# EAGLE design Shield r0 (EAGLE 6.5.0)
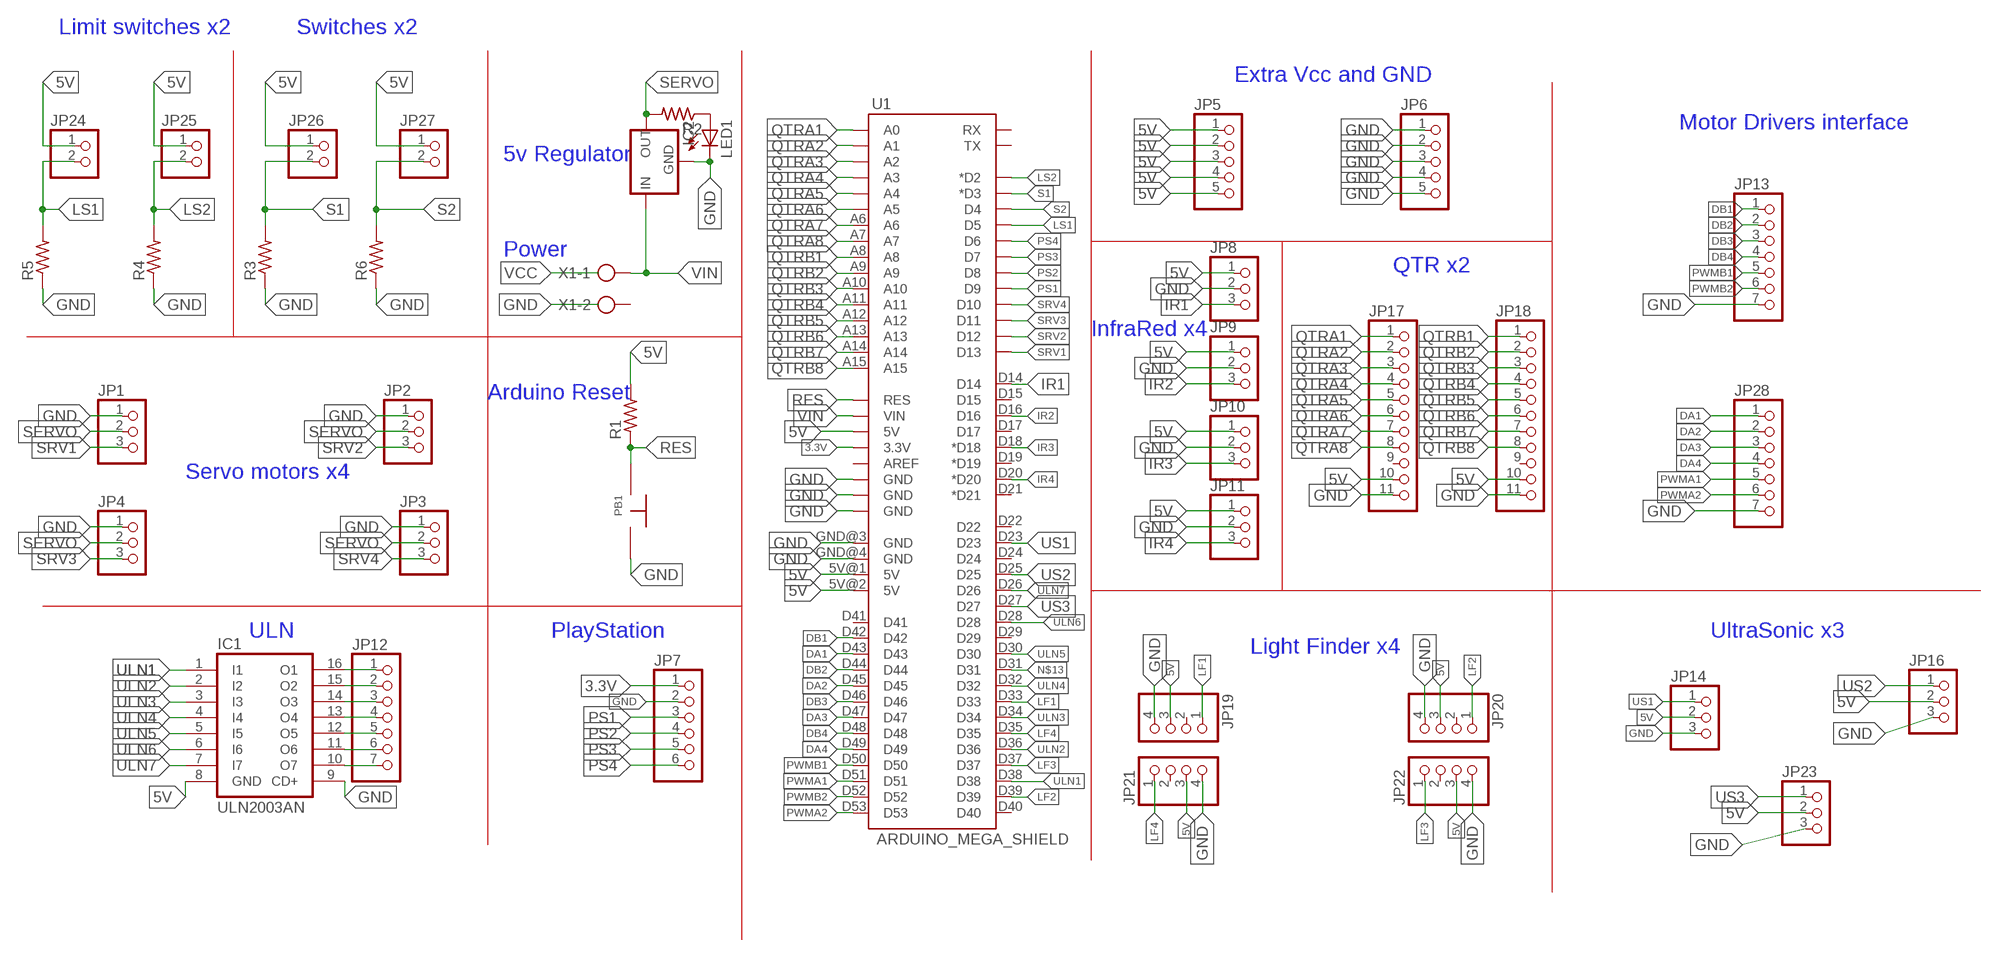
[diagram p0: schematic, sheet 1]

## Parts
IC1  ULN2003AN  [DIL16]
IC2  78XXS  [78XXS]
JP1  PINHD-1X3  [1X03]
JP2  PINHD-1X3  [1X03]
JP3  PINHD-1X3  [1X03]
JP4  PINHD-1X3  [1X03]
JP5  PINHD-1X5  [1X05]
JP6  PINHD-1X5  [1X05]
JP7  PINHD-1X6  [1X06]
JP8  PINHD-1X3  [1X03]
JP9  PINHD-1X3  [1X03]
JP10  PINHD-1X3  [1X03]
JP11  PINHD-1X3  [1X03]
JP12  PINHD-1X7  [1X07]
JP13  PINHD-1X7  [1X07]
JP14  PINHD-1X3  [1X03]
JP16  PINHD-1X3  [1X03]
JP17  PINHD-1X11  [1X11]
JP18  PINHD-1X11  [1X11]
JP19  PINHD-1X4  [1X04]
JP20  PINHD-1X4  [1X04]
JP21  PINHD-1X4  [1X04]
JP22  PINHD-1X4  [1X04]
JP23  PINHD-1X3  [1X03]
JP24  PINHD-1X2  [1X02]
JP25  PINHD-1X2  [1X02]
JP26  PINHD-1X2  [1X02]
JP27  PINHD-1X2  [1X02]
JP28  PINHD-1X7  [1X07]
LED1  LED5MM  [LED5MM]
PB1  PUSH  [PUSHBUTTON]
R1  R-US_0207/10  [0207/10]
R2  R-US_0207/10  [0207/10]
R3  R-US_0207/10  [0207/10]
R4  R-US_0207/10  [0207/10]
R5  R-US_0207/10  [0207/10]
R6  R-US_0207/10  [0207/10]
U1  ARDUINO_MEGA_SHIELD  [ARDUINO_MEGA_SHIELD]
X1  AK500/2-H  [AK500/2-H]

## Nets
3.3V: JP7.1 U1.3.3V
5V: IC1.8(GND) JP5.1 JP5.2 JP5.3 JP5.4 JP5.5 JP8.1 JP9.1 JP10.1 JP11.1 JP14.2 JP16.2 JP17.10 JP18.10 JP19.3 JP20.3 JP21.3 JP22.3 JP23.2 JP24.1 JP25.1 JP26.1 JP27.1 R1.2 U1.5V@0(5V) U1.5V@1(5V) U1.5V@2(5V)
DA1: JP28.1 U1.D43
DA2: JP28.2 U1.D45
DA3: JP28.3 U1.D47
DA4: JP28.4 U1.D49
DB1: JP13.1 U1.D42
DB2: JP13.2 U1.D44
DB3: JP13.3 U1.D46
DB4: JP13.4 U1.D48
GND: IC1.9(CD+) IC2.GND JP1.1 JP2.1 JP3.1 JP4.1 JP6.1 JP6.2 JP6.3 JP6.4 JP6.5 JP7.2 JP8.2 JP9.2 JP10.2 JP11.2 JP13.7 JP14.3 JP16.3 JP17.11 JP18.11 JP19.4 JP20.4 JP21.4 JP22.4 JP23.3 JP28.7 LED1.K(C) PB1.P$2 R3.1 R4.1 R5.1 R6.1 U1.GND@0(GND) U1.GND@1(GND) U1.GND@2(GND) U1.GND@3(GND) U1.GND@4(GND)
IR1: JP8.3 U1.D14
IR2: JP9.3 U1.D16
IR3: JP10.3 U1.D18(*D18)
IR4: JP11.3 U1.D20(*D20)
LF1: JP19.1 U1.D33
LF2: JP20.1 U1.D39
LF3: JP22.1 U1.D37
LF4: JP21.1 U1.D35
LS1: JP24.2 R5.2 U1.D5
LS2: JP25.2 R4.2 U1.D2(*D2)
N$1: LED1.A R2.1
N$2: IC1.16(O1) JP12.1
N$3: IC1.15(O2) JP12.2
N$4: IC1.14(O3) JP12.3
N$5: IC1.13(O4) JP12.4
N$6: IC1.12(O5) JP12.5
N$7: IC1.11(O6) JP12.6
N$8: IC1.10(O7) JP12.7
N$13: U1.D31
PS1: JP7.3 U1.D9
PS2: JP7.4 U1.D8
PS3: JP7.5 U1.D7
PS4: JP7.6 U1.D6
PWMA1: JP28.5 U1.D51
PWMA2: JP28.6 U1.D53
PWMB1: JP13.5 U1.D50
PWMB2: JP13.6 U1.D52
QTRA1: JP17.1 U1.A0
QTRA2: JP17.2 U1.A1
QTRA3: JP17.3 U1.A2
QTRA4: JP17.4 U1.A3
QTRA5: JP17.5 U1.A4
QTRA6: JP17.6 U1.A5
QTRA7: JP17.7 U1.A6
QTRA8: JP17.8 U1.A7
QTRB1: JP18.1 U1.A8
QTRB2: JP18.2 U1.A9
QTRB3: JP18.3 U1.A10
QTRB4: JP18.4 U1.A11
QTRB5: JP18.5 U1.A12
QTRB6: JP18.6 U1.A13
QTRB7: JP18.7 U1.A14
QTRB8: JP18.8 U1.A15
RES: PB1.P$1 R1.1 U1.RES
S1: JP26.2 R3.2 U1.D3(*D3)
S2: JP27.2 R6.2 U1.D4
SERVO: IC2.OUT JP1.2 JP2.2 JP3.2 JP4.2 R2.2
SRV1: JP1.3 U1.D13
SRV2: JP2.3 U1.D12
SRV3: JP4.3 U1.D11
SRV4: JP3.3 U1.D10
ULN1: IC1.1(I1) U1.D38
ULN2: IC1.2(I2) U1.D36
ULN3: IC1.3(I3) U1.D34
ULN4: IC1.4(I4) U1.D32
ULN5: IC1.5(I5) U1.D30
ULN6: IC1.6(I6) U1.D28
ULN7: IC1.7(I7) U1.D26
US1: JP14.1 U1.D23
US2: JP16.1 U1.D25
US3: JP23.1 U1.D27
VIN: IC2.IN U1.VIN X1.1
Unconnected: JP17.9 JP18.9 JP19.2 JP20.2 JP21.2 JP22.2 U1.AREF U1.D15 U1.D17 U1.D19(*D19) U1.D21(*D21) U1.D22 U1.D24 U1.D29 U1.D40 U1.D41 U1.RX U1.TX X1.2

## Notes on the sheet
- Limit switches x2 | Switches x2
- Extra Vcc and GND
- Motor Drivers interface
- 5v Regulator
- Power
- QTR x2
- InfraRed x4
- Arduino Reset
- Servo motors x4
- ULN | PlayStation | UltraSonic x3
- Light Finder x4

## Library data of the parts
IC1 = uln-udn:ULN2003A: DRIVER ARRAY
IC2 = v-reg:78XXS: VOLTAGE REGULATOR
JP1-JP4 JP8-JP11 JP14 JP16 JP23 = pinhead:PINHD-1X3: PIN HEADER
JP5 JP6 = pinhead:PINHD-1X5: PIN HEADER
JP7 = pinhead:PINHD-1X6: PIN HEADER
JP12 JP13 JP28 = pinhead:PINHD-1X7: PIN HEADER
JP17 JP18 = pinhead:PINHD-1X11: PIN HEADER
JP19-JP22 = pinhead:PINHD-1X4: PIN HEADER
JP24-JP27 = pinhead:PINHD-1X2: PIN HEADER
LED1 = led:LED: LED OSRAM: - CHIPLED LG R971, LG N971, LY N971, LG Q971, LY Q971, LO R971, LY R971 LH N974, LH R974 LS Q976, LO Q976, LY Q976 LO Q996 - Hyper CHIPLED LW Q18S LB Q993, LB Q99A, LB R99A - SideLED LS A670, LO A670, LY A670, LG A670, LP A670 LB A673, LV A673, LT A673, LW A673 LH A674 LY A675 LS A676, LA A676, LO A676, LY A676, LW A676 LS A679, LY A679, LG A679 - Hyper Micro SIDELED® LS Y876, LA Y876, LO Y876, LY Y876 LT Y87S - SmartLED LW L88C, LW L88S LB L89C, LB L89S, LG L890 LS L89K, LO L89K, LY L89K LS L896, LA L896, LO L896, LY L896 - TOPLED LS T670, LO T670, LY T670, LG T670, LP T670 LSG T670, LSP T670, LSY T670, LOP T670, LYG T670 LG T671, LOG T671, LSG T671 LB T673, LV T673, LT T673, LW T673 LH T674 LS T676, LA T676, LO T676, LY T676, LB T676, LH T676, LSB T676, LW T676 LB T67C, LV T67C, LT T67C, LS T67K, LO T67K, LY T67K, LW E67C LS E67B, LA E67B, LO E67B, LY E67B, LB E67C, LV E67C, LT E67C LW T67C LS T679, LY T679, LG T679 LS T770, LO T770, LY T770, LG T770, LP T770 LB T773, LV T773, LT T773, LW T773 LH T774 LS E675, LA E675, LY E675, LS T675 LS T776, LA T776, LO T776, LY T776, LB T776 LHGB T686 LT T68C, LB T68C - Hyper Mini TOPLED® LB M676 - Mini TOPLED Santana® LG M470 LS M47K, LO M47K, LY M47K Source: http://www.osram.convergy.de LUXEON: - LUMILED® LXK2-PW12-R00, LXK2-PW12-S00, LXK2-PW14-U00, LXK2-PW14-V00 LXK2-PM12-R00, LXK2-PM12-S00, LXK2-PM14-U00 LXK2-PE12-Q00, LXK2-PE12-R00, LXK2-PE12-S00, LXK2-PE14-T00, LXK2-PE14-U00 LXK2-PB12-K00, LXK2-PB12-L00, LXK2-PB12-M00, LXK2-PB14-N00, LXK2-PB14-P00, LXK2-PB14-Q00 LXK2-PR12-L00, LXK2-PR12-M00, LXK2-PR14-Q00, LXK2-PR14-R00 LXK2-PD12-Q00, LXK2-PD12-R00, LXK2-PD12-S00 LXK2-PH12-R00, LXK2-PH12-S00 LXK2-PL12-P00, LXK2-PL12-Q00, LXK2-PL12-R00 Source: www.luxeon.com KINGBRIGHT: KA-3528ASYC Source: www.kingbright.com
PB1 = pushbutton:PUSH
R1-R6 = rcl:R-US_: RESISTOR, American symbol
U1 = RepRapjr:ARDUINO_MEGA_SHIELD
X1 = con-ptr500:AK500/2-H: CONNECTOR Aug. 2004 / PTR Meßtechnik: Die Bezeichnung der Serie AK505 wurde geändert. Es handelt sich hierbei um AK500 in horizontaler Ausführung.; OC_FARNELL: unknown; OC_NEWARK: unknown

## Board
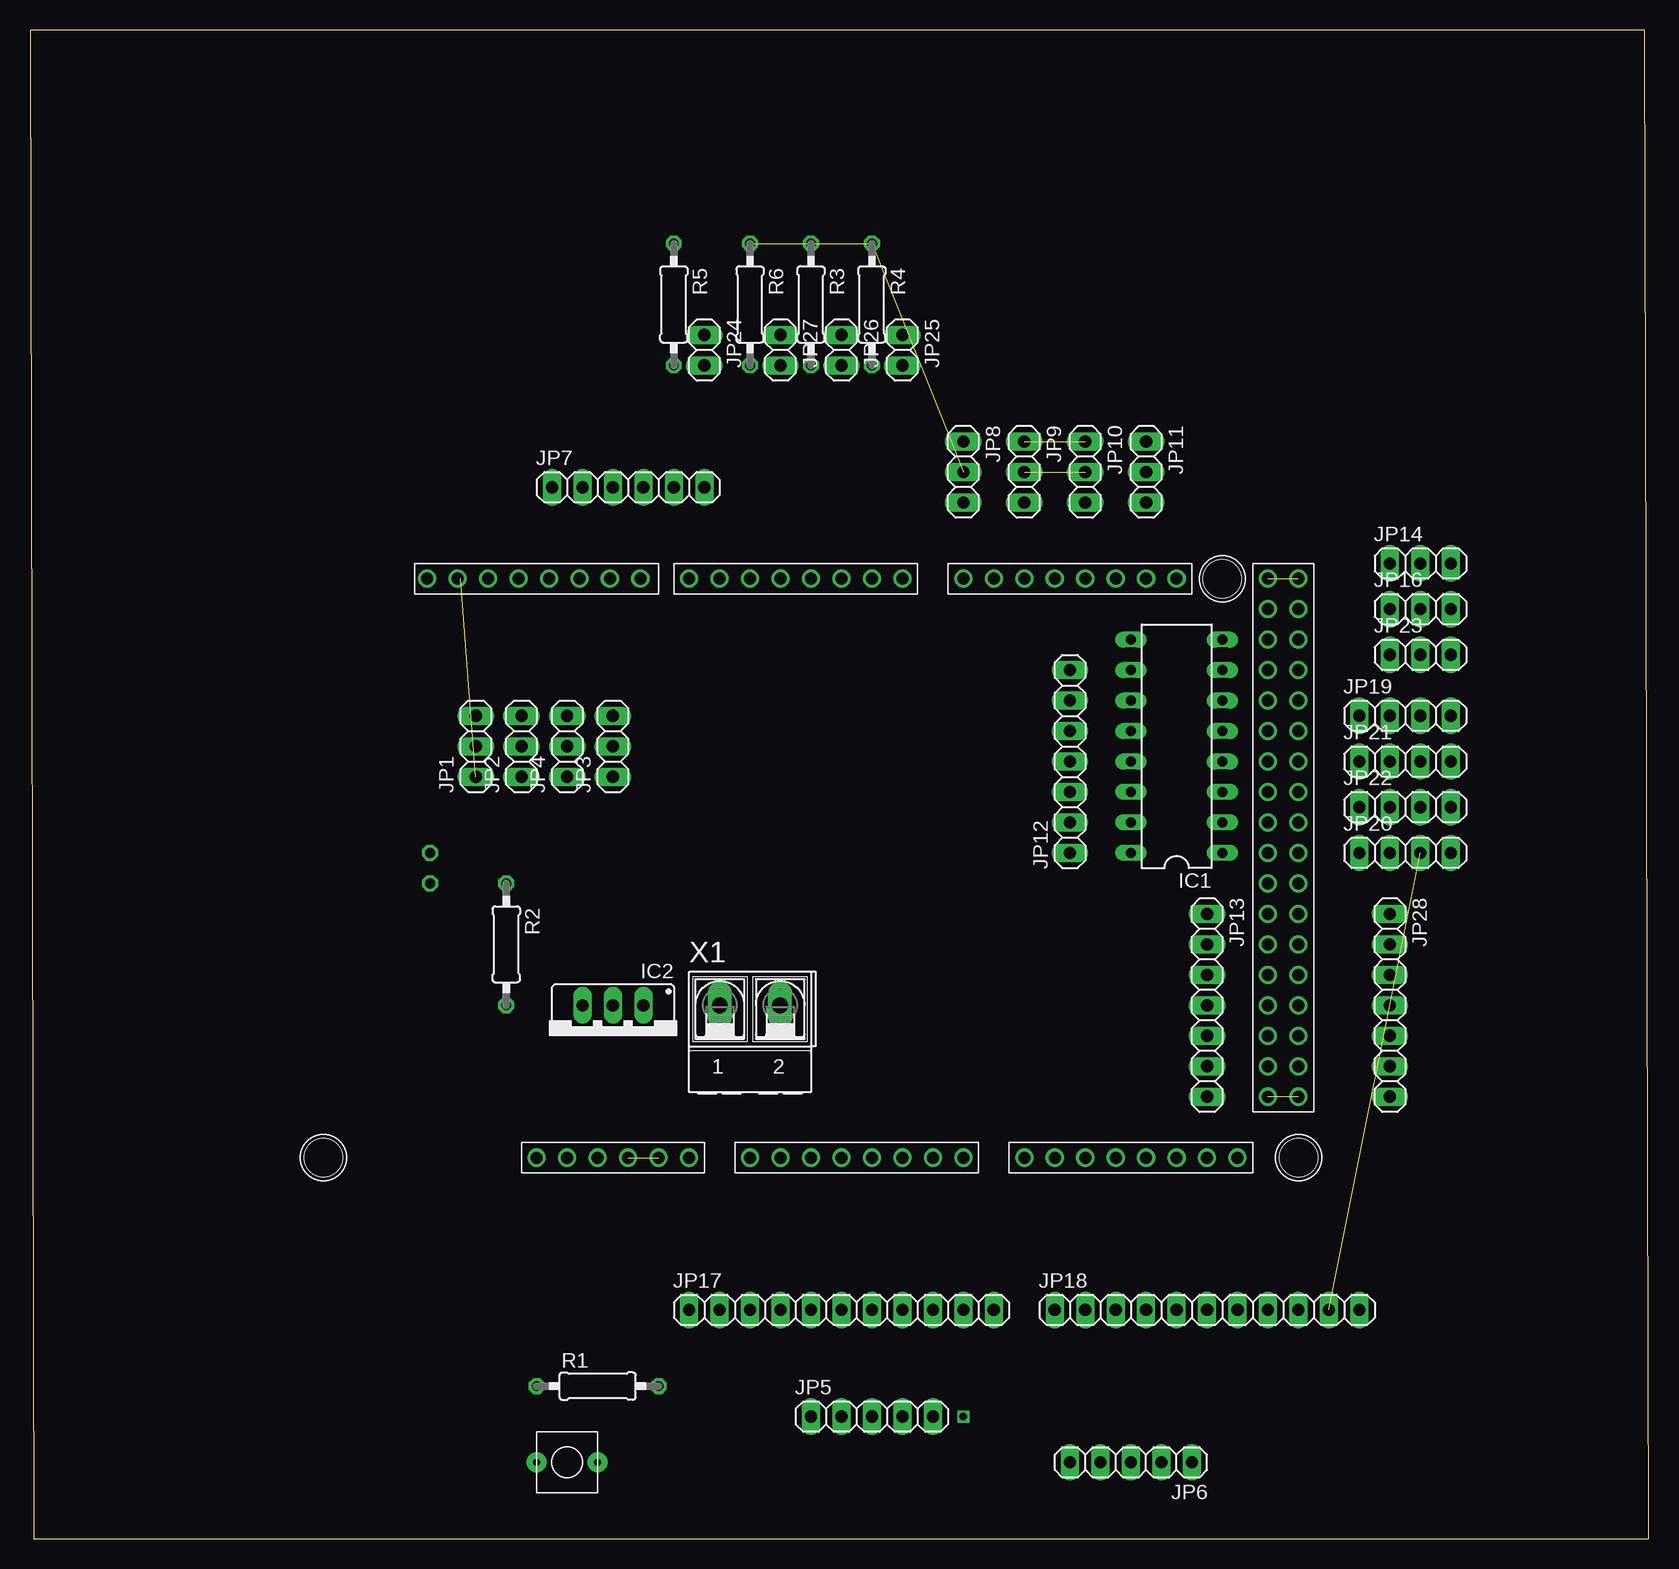
[diagram p1: board, top side]
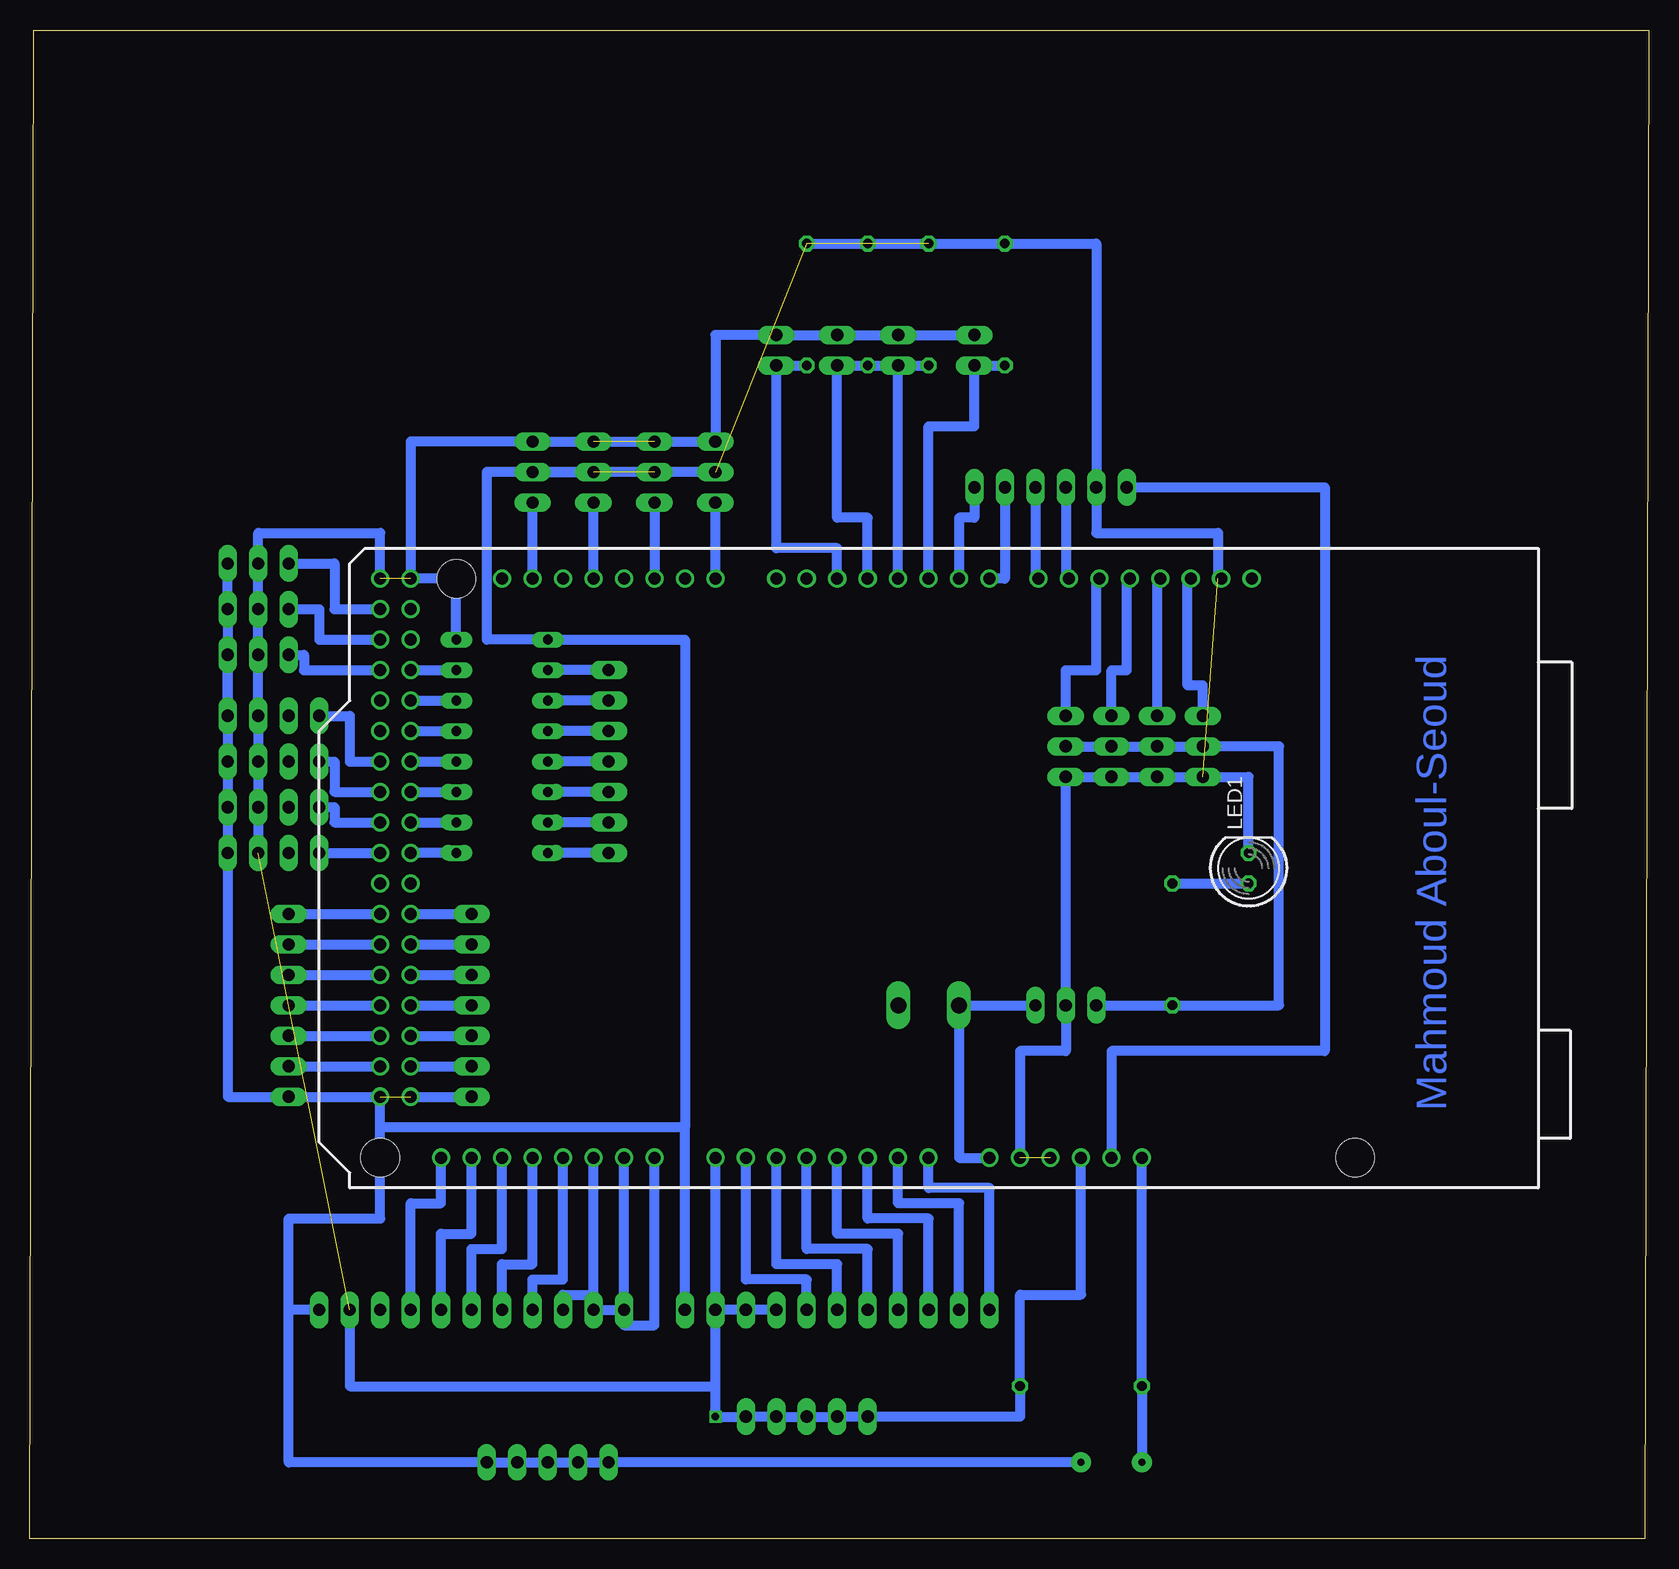
[diagram p2: board, bottom side, seen from below]

Size 134.93 x 125.75 mm. Coordinates in mm from the lower left corner, seen from the top.
Outline: 0.33,0 134.93,0 134.62,125.75 0,125.73 0.33,0
Copper layers (1*16): Top 0.035mm / dielectric 1.5mm / Bottom 0.035mm
Design rules "default": minimum track width 10mil, minimum drill 24mil, track to track 8mil, track to pad 8mil, pad to pad 8mil, via to via 8mil, smd to smd 8mil, copper to edge 40mil, drill to drill 8mil, minimum pad ring 10mil, minimum via ring 8mil, stop-mask expansion 4mil, vias tented up to drill 0mil, thermal gap 10mil

### Footprints (pad centres in the part's own frame; a part is rotated, then mirrored left to right if it is on the bottom)
DIL16 = drill 0.813 long: 1 -8.89,-3.81; 2 -6.35,-3.81; 3 -3.81,-3.81; 4 -1.27,-3.81; 5 1.27,-3.81; 6 3.81,-3.81; 7 6.35,-3.81; 8 8.89,-3.81; 9 8.89,3.81; 10 6.35,3.81; 11 3.81,3.81; 12 1.27,3.81; 13 -1.27,3.81; 14 -3.81,3.81; 15 -6.35,3.81; 16 -8.89,3.81
78XXS = drill 1.016 long: GND 0,-2.54; IN -2.54,-2.54; OUT 2.54,-2.54
1X03 = drill 1.016 long: 1 -2.54,0; 2 0,0; 3 2.54,0
1X05 = drill 1.016 long: 1 -5.08,0; 2 -2.54,0; 3 0,0; 4 2.54,0; 5 5.08,0
1X06 = drill 1.016 long: 1 -6.35,0; 2 -3.81,0; 3 -1.27,0; 4 1.27,0; 5 3.81,0; 6 6.35,0
1X07 = drill 1.016 long: 1 -7.62,0; 2 -5.08,0; 3 -2.54,0; 4 0,0; 5 2.54,0; 6 5.08,0; 7 7.62,0
1X11 = drill 1.016 long: 1 -12.7,0; 2 -10.16,0; 3 -7.62,0; 4 -5.08,0; 5 -2.54,0; 6 0,0; 7 2.54,0; 8 5.08,0; 9 7.62,0; 10 10.16,0; 11 12.7,0
1X04 = drill 1.016 long: 1 -3.81,0; 2 -1.27,0; 3 1.27,0; 4 3.81,0
1X02 = drill 1.016 long: 1 -1.27,0; 2 1.27,0
LED5MM = drill 0.813 octagon: A -1.27,0; K 1.27,0
PUSHBUTTON = drill 0.6 pad 1.676: P$1 -2.54,0; P$2 2.54,0
0207/10 = drill 0.813 octagon: 1 -5.08,0; 2 5.08,0
ARDUINO_MEGA_SHIELD = drill 1 pad 1.422: 3.3V 50.8,26.67; 5V@0 50.8,29.21; 5V@1 2.54,85.09; 5V@2 2.54,87.63; A0 50.8,41.91; A1 50.8,44.45; A2 50.8,46.99; A3 50.8,49.53; A4 50.8,52.07; A5 50.8,54.61; A6 50.8,57.15; A7 50.8,59.69; A8 50.8,64.77; A9 50.8,67.31; A10 50.8,69.85; A11 50.8,72.39; A12 50.8,74.93; A13 50.8,77.47; A14 50.8,80.01; A15 50.8,82.55; AREF 2.54,14.986; D2 2.54,49.53; D3 2.54,46.99; D4 2.54,44.45; D5 2.54,41.91; D6 2.54,39.37; D7 2.54,36.83; D8 2.54,32.766; D9 2.54,30.226; D10 2.54,27.686; D11 2.54,25.146; D12 2.54,22.606; D13 2.54,20.066; D14 2.54,59.69; D15 2.54,62.23; D16 2.54,64.77; D17 2.54,67.31; D18 2.54,69.85; D19 2.54,72.39; D20 2.54,74.93; D21 2.54,77.47; D22 5.08,85.09; D23 5.08,87.63; D24 7.62,85.09; D25 7.62,87.63; D26 10.16,85.09; D27 10.16,87.63; D28 12.7,85.09; D29 12.7,87.63; D30 15.24,85.09; D31 15.24,87.63; D32 17.78,85.09; D33 17.78,87.63; D34 20.32,85.09; D35 20.32,87.63; D36 22.86,85.09; D37 22.86,87.63; D38 25.4,85.09; D39 25.4,87.63; D40 27.94,85.09; D41 27.94,87.63; D42 30.48,85.09; D43 30.48,87.63; D44 33.02,85.09; D45 33.02,87.63; D46 35.56,85.09; D47 35.56,87.63; D48 38.1,85.09; D49 38.1,87.63; D50 40.64,85.09; D51 40.64,87.63; D52 43.18,85.09; D53 43.18,87.63; GND@0 50.8,31.75; GND@1 50.8,34.29; GND@2 2.54,17.526; GND@3 45.72,85.09; GND@4 45.72,87.63; RES 50.8,24.13; RX 2.54,54.61; TX 2.54,52.07; VIN 50.8,36.83 | hole 3.2: 2.54,81.28; 50.8,87.63; 50.8,6.35
AK500/2-H = drill 1.321 long: 1 -2.515,0; 2 2.515,0

### Placement (x,y rotation side)
IC1  95.58,66.04 90 top
IC2  48.59,41.91 180 top
JP1  37.16,66.04 90 top
JP2  40.97,66.04 90 top
JP3  48.59,66.04 90 top
JP4  44.78,66.04 90 top
JP5  70.18,10.16 0 top
JP6  91.77,6.35 180 top
JP7  49.86,87.63 0 top
JP8  77.8,88.9 270 top
JP9  82.88,88.9 270 top
JP10  87.96,88.9 270 top
JP11  93.04,88.9 270 top
JP12  86.69,64.77 90 top
JP13  98.12,44.45 270 top
JP14  115.9,81.28 0 top
JP16  115.9,77.47 0 top
JP17  67.64,19.05 0 top
JP18  98.12,19.05 0 top
JP19  114.63,68.58 0 top
JP20  114.63,57.15 0 top
JP21  114.63,64.77 0 top
JP22  114.63,60.96 0 top
JP23  115.9,73.66 0 top
JP24  56.21,99.06 270 top
JP25  72.72,99.06 270 top
JP26  67.64,99.06 270 top
JP27  62.56,99.06 270 top
JP28  113.36,44.45 270 top
LED1  33.35,55.88 90 bottom
PB1  44.78,6.35 0 top
R1  47.32,12.7 0 top
R2  39.7,49.53 270 top
R3  65.1,102.87 270 top
R4  70.18,102.87 270 top
R5  53.67,102.87 270 top
R6  60.02,102.87 270 top
U1  18.11,82.55 270 top
X1  60.02,44.45 0 top

### Tracks (layer width: path | path; a pad name or v marks a point on that pad's centre or on a via)
3.3V
  Bottom 0.813: JP7.1 27,87.63 27,40.64 44.78,40.64 U1.3.3V
5V  (via drill 0.6)  (3 unrouted)
  Bottom 0.813: 77.8,12.7 v77.8,10.16 JP5.5 JP5.4 JP5.3 JP5.2 JP5.1 52.4,10.16 R1.2 52.4,20.32 47.32,20.32 U1.5V@0 | JP18.10 108.28,12.7 77.8,12.7 | 77.8,12.7 JP17.10 | IC1.8 99.39,80.01 U1.5V@1 103.2,91.44 JP11.1 JP10.1 JP8.1 77.8,100.33 JP25.1 JP26.1 JP27.1 JP24.1 | JP20.3 JP22.3 JP21.3 JP19.3 JP23.2 JP16.2 JP14.2 115.9,83.82 105.74,83.82 U1.5V@2
DA1
  Bottom 0.813: JP28.1 U1.D43
DA2
  Bottom 0.813: JP28.2 U1.D45
DA3
  Bottom 0.813: JP28.3 U1.D47
DA4
  Bottom 0.813: JP28.4 U1.D49
DB1
  Bottom 0.813: U1.D42 JP13.1
DB2
  Bottom 0.813: U1.D44 JP13.2
DB3
  Bottom 0.813: U1.D46 JP13.3
DB4
  Bottom 0.813: U1.D48 JP13.4
GND  (7 unrouted)
  Bottom 0.813: JP11.2 JP10.2 JP8.2 JP11.2 | 113.36,19.05 113.36,6.35 JP6.1 JP6.2 JP6.3 JP6.4 JP6.5 PB1.P$2 | 113.36,19.05 113.36,26.67 105.74,26.67 105.74,34.29 | 105.74,34.29 U1.GND@4 JP28.7 118.44,36.83 JP23.3 | JP17.11 80.34,34.29 | 80.34,34.29 105.74,34.29 | U1.GND@1 52.4,40.64 48.59,40.64 IC2.GND JP3.1 JP4.1 JP2.1 JP1.1 33.35,63.5 LED1.K | U1.GND@2 35.89,80.01 35.89,83.82 46.05,83.82 JP7.2 46.05,107.95 R5.1 R4.1 | JP11.2 96.85,88.9 96.85,74.93 IC1.9 80.34,74.93 80.34,34.29 | JP20.4 JP22.4 JP21.4 JP19.4 JP23.3 | U1.GND@3 JP13.7 | JP23.3 JP16.3 JP14.3 | JP18.11 113.36,19.05
IR1
  Bottom 0.813: U1.D14 JP8.3
IR2
  Bottom 0.813: JP9.3 U1.D16
IR3
  Bottom 0.813: U1.D18 JP10.3
IR4
  Bottom 0.813: U1.D20 JP11.3
LF1
  Bottom 0.813: JP19.1 108.28,68.58 108.28,64.77 U1.D33
LF2
  Bottom 0.813: JP20.1 U1.D39
LF3
  Bottom 0.813: JP22.1 109.55,60.96 109.55,59.69 U1.D37
LF4
  Bottom 0.813: JP21.1 109.55,64.77 109.55,62.23 U1.D35
LS1
  Bottom 0.813: R5.2 JP24.2 56.21,92.71 60.02,92.71 U1.D5
LS2
  Bottom 0.813: R4.2 JP25.2 72.72,82.55 67.64,82.55 U1.D2
N$1
  Bottom 0.813: R2.1 LED1.A
N$2
  Bottom 0.813: JP12.1 IC1.16
N$3
  Bottom 0.813: JP12.2 IC1.15
N$4
  Bottom 0.813: JP12.3 IC1.14
N$5
  Bottom 0.813: JP12.4 IC1.13
N$6
  Bottom 0.813: JP12.5 IC1.12
N$7
  Bottom 0.813: JP12.6 IC1.11
N$8
  Bottom 0.813: JP12.7 IC1.10
PS1
  Bottom 0.813: JP7.3 48.59,80.01 U1.D9
PS2
  Bottom 0.813: JP7.4 51.13,80.01 U1.D8
PS3
  Bottom 0.813: JP7.5 53.67,80.01 U1.D7
PS4
  Bottom 0.813: JP7.6 56.21,85.09 57.48,85.09 U1.D6
PWMA1
  Bottom 0.813: JP28.5 U1.D51
PWMA2
  Bottom 0.813: JP28.6 U1.D53
PWMB1
  Bottom 0.813: U1.D50 JP13.5
PWMB2
  Bottom 0.813: U1.D52 JP13.6
QTRA1
  Bottom 0.813: JP17.1 54.94,29.21 60.02,29.21 U1.A0
QTRA2
  Bottom 0.813: JP17.2 57.48,27.94 62.56,27.94 U1.A1
QTRA3
  Bottom 0.813: JP17.3 60.02,26.67 65.1,26.67 U1.A2
QTRA4
  Bottom 0.813: JP17.4 62.56,25.4 67.64,25.4 U1.A3
QTRA5
  Bottom 0.813: JP17.5 65.1,24.13 70.18,24.13 U1.A4
QTRA6
  Bottom 0.813: JP17.6 67.64,22.86 72.72,22.86 U1.A5
QTRA7
  Bottom 0.813: JP17.7 70.18,21.59 75.26,21.59 U1.A6
QTRA8
  Bottom 0.813: JP17.8 77.8,19.05 U1.A7
QTRB1
  Bottom 0.813: JP18.1 85.42,17.78 82.88,17.78 U1.A8
QTRB2
  Bottom 0.813: JP18.2 85.42,19.05 U1.A9
QTRB3
  Bottom 0.813: JP18.3 90.5,20.32 87.96,20.32 U1.A10
QTRB4
  Bottom 0.813: JP18.4 93.04,21.59 90.5,21.59 U1.A11
QTRB5
  Bottom 0.813: JP18.5 95.58,22.86 93.04,22.86 U1.A12
QTRB6
  Bottom 0.813: JP18.6 98.12,24.13 95.58,24.13 U1.A13
QTRB7
  Bottom 0.813: JP18.7 100.66,25.4 98.12,25.4 U1.A14
QTRB8
  Bottom 0.813: JP18.8 103.2,27.94 100.66,27.94 U1.A15
RES
  Bottom 0.813: U1.RES R1.1 PB1.P$1
S1
  Bottom 0.813: 62.56,97.79 R3.2 JP26.2 67.64,85.09 65.1,85.09 U1.D3
S2
  Bottom 0.813: R6.2 JP27.2 U1.D4
SERVO
  Bottom 0.813: R2.2 IC2.OUT 30.81,44.45 30.81,66.04 JP1.2 JP2.2 JP4.2 JP3.2
SRV1
  Bottom 0.813: JP1.3 37.16,71.12 38.43,71.12 38.43,80.01 U1.D13
SRV2
  Bottom 0.813: JP2.3 40.97,80.01 U1.D12
SRV3
  Bottom 0.813: JP4.3 44.78,72.39 43.51,72.39 43.51,80.01 U1.D11
SRV4
  Bottom 0.813: JP3.3 48.59,72.39 46.05,72.39 46.05,80.01 U1.D10
ULN1
  Bottom 0.813: IC1.1 U1.D38
ULN2
  Bottom 0.813: U1.D36 IC1.2
ULN3
  Bottom 0.813: U1.D34 IC1.3
ULN4
  Bottom 0.813: U1.D32 IC1.4
ULN5
  Bottom 0.813: U1.D30 IC1.5
ULN6
  Bottom 0.813: U1.D28 IC1.6
ULN7
  Bottom 0.813: U1.D26 IC1.7
US1
  Bottom 0.813: JP14.1 109.55,81.28 109.55,77.47 U1.D23
US2
  Bottom 0.813: JP16.1 110.82,77.47 110.82,74.93 U1.D25
US3
  Bottom 0.813: JP23.1 112.09,73.66 112.09,72.39 U1.D27
VIN
  Bottom 0.813: 54.96,31.75 U1.VIN 57.48,31.75 57.48,44.45 X1.1 IC2.IN

### Text on the board
Bottom: Mahmoud Aboul-Seoud
seperation: Limit Switches / Push Buttons | InfraRed | UltraSonic | Servo Motors | ULN | Light Finder | Motor Driver B | Motor Driver A | Regulator | QTR B | QTR A | Gnd x5 | Gnd x5 | Reset | Vcc x5